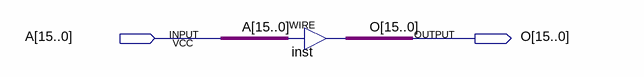
[diagram p0: schematic sheet]
// Quartus schematic atoa.bdf as structural Verilog: 1 symbols, 2 pins
module atoa (
  input  [15:0] A,
  output [15:0] O
);

  assign O = A;  // WIRE inst
endmodule
